# EAGLE schematic controller5 (EAGLE 7.7.0)

## Sheet 1 of 2
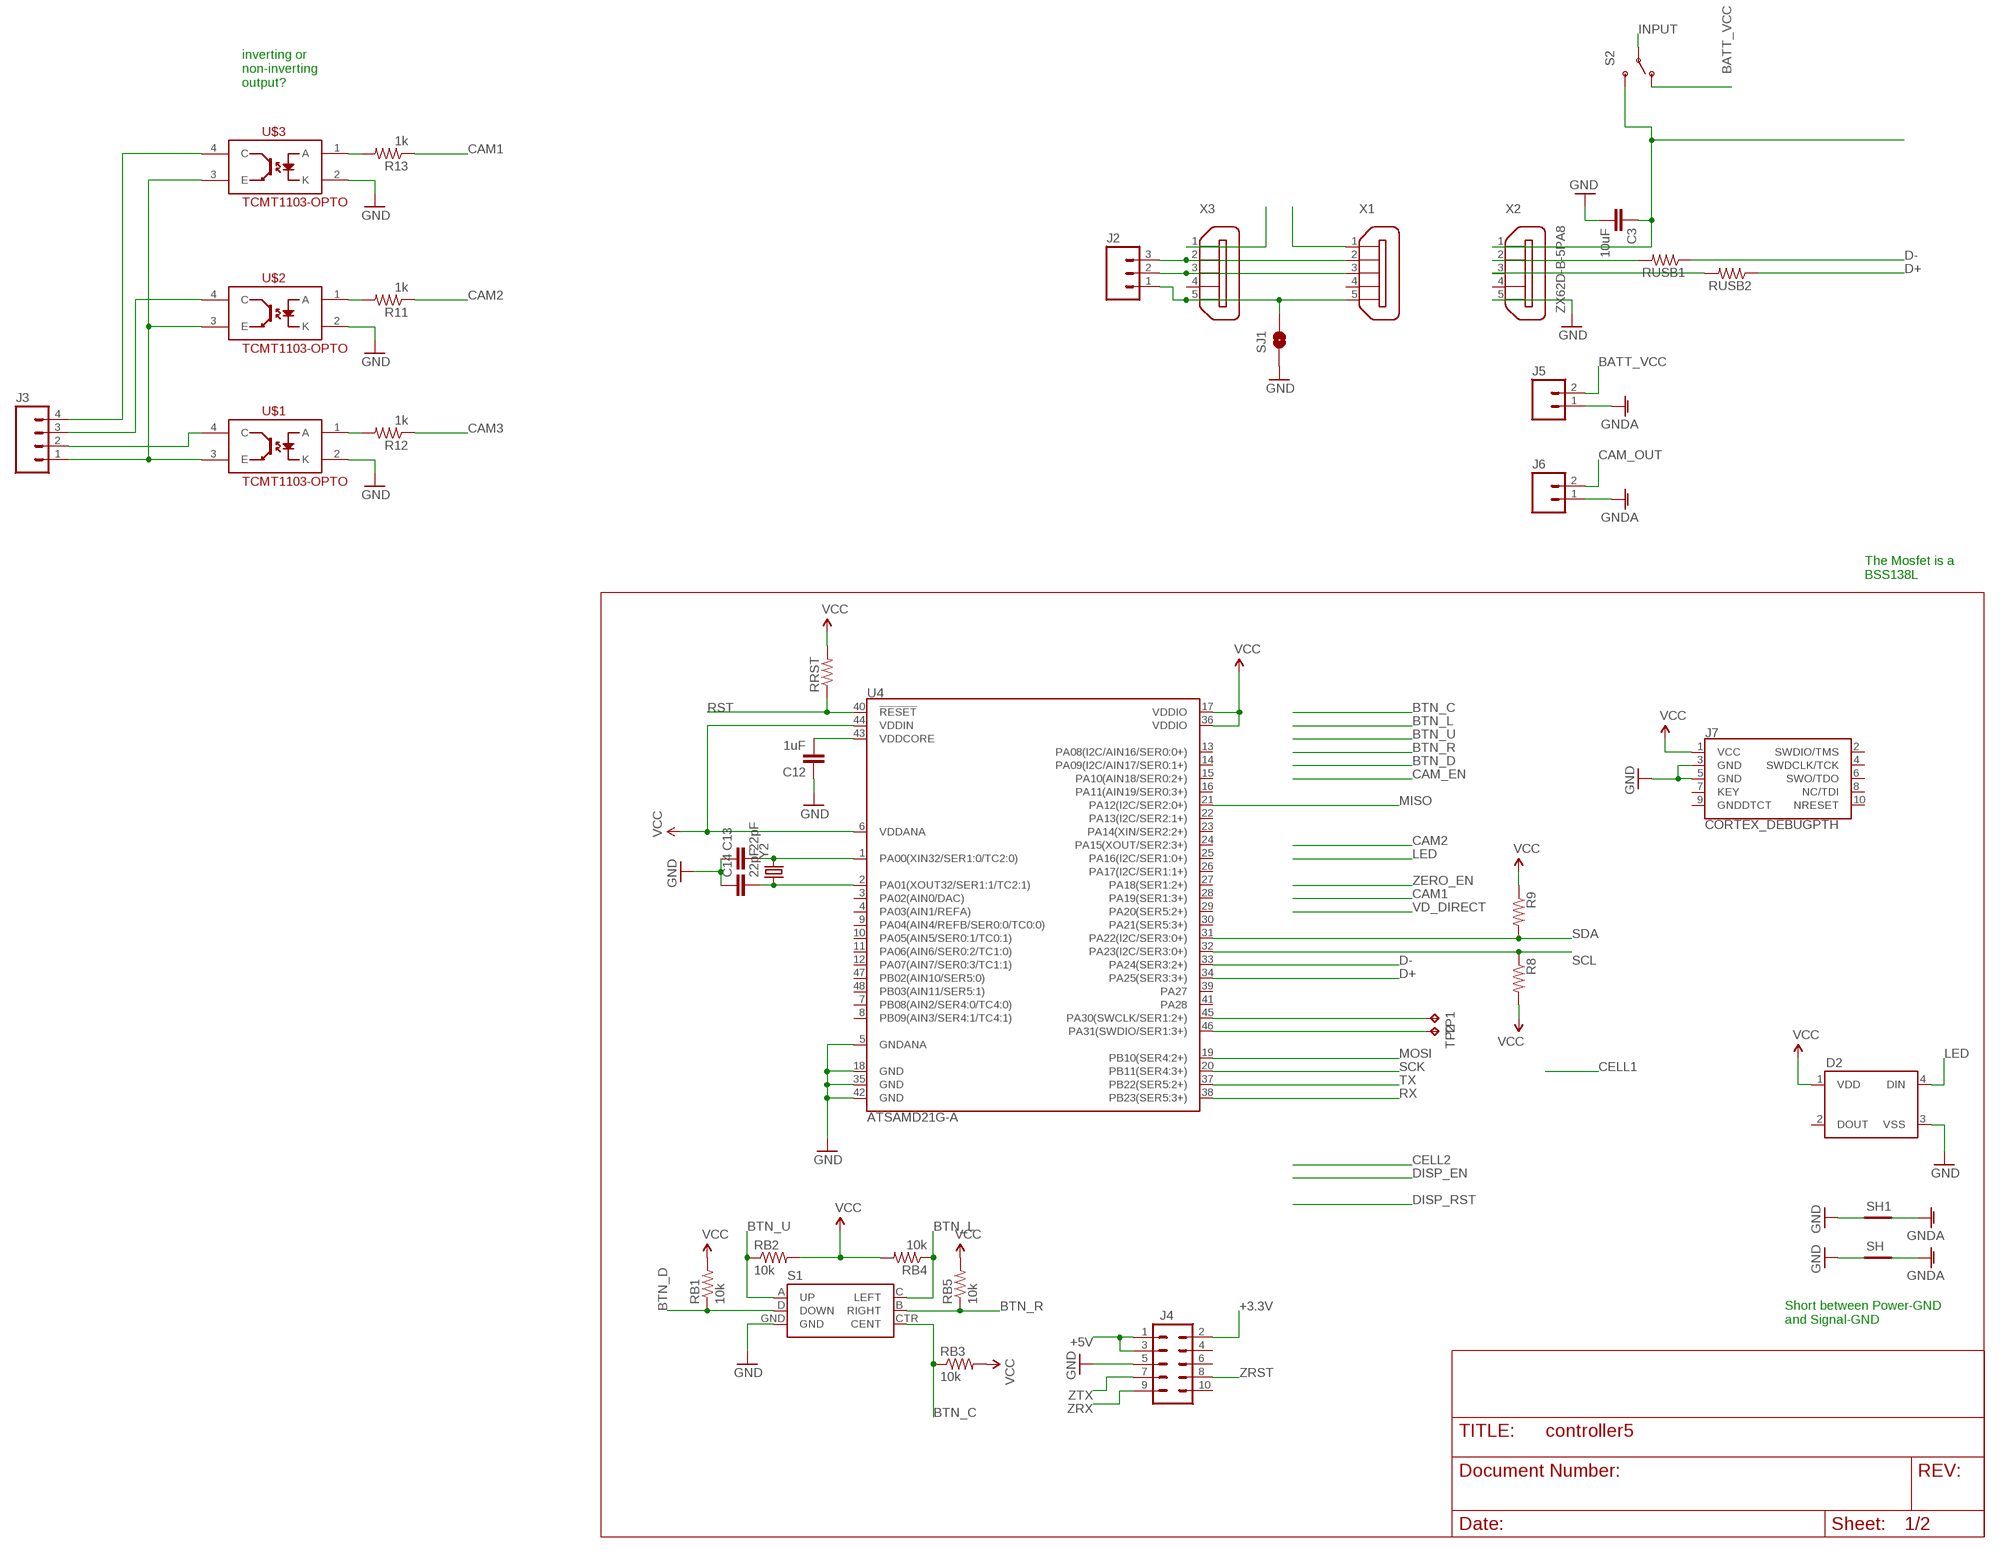
[diagram p0: schematic, sheet 1]

### Parts
C3  10uF  CAP1206  [1206]
C12  1uF  CAP1206  [1206]
C13  22pF  CAP1206  [1206]
C14  22pF  CAP1206  [1206]
D2  WS2812B  [WS2812B]
J2  M03LOCK  [1X03_LOCK]
J3  M04LOCK  [1X04_LOCK]
J4  M05X2NO_SILK  [2X5_NOSILK]
J5  M023.5MM_LOCK  [SCREWTERMINAL-3.5MM-2_LOCK]
J6  M023.5MM_LOCK  [SCREWTERMINAL-3.5MM-2_LOCK]
J7  CORTEX_DEBUGPTH  [2X5-PTH-1.27MM]
R8  RESISTOR1206  [1206]
R9  RESISTOR1206  [1206]
R11  1k  RESISTOR1206  [1206]
R12  1k  RESISTOR1206  [1206]
R13  1k  RESISTOR1206  [1206]
RB1  10k  RESISTOR1206  [1206]
RB2  10k  RESISTOR1206  [1206]
RB3  10k  RESISTOR1206  [1206]
RB4  10k  RESISTOR1206  [1206]
RB5  10k  RESISTOR1206  [1206]
RRST  RESISTOR1206  [1206]
RUSB1  RESISTOR1206  [1206]
RUSB2  RESISTOR1206  [1206]
S1  JOYSTICK_MINI  [JOYSTICK_MINI]
S2  SWITCH-SPDTPTH_LOCK  [SWITCH-SPDT_LOCK.007S]
SH  SHORT-HT5  [SHORT_TOP-50]
SH1  SHORT-HT5  [SHORT_TOP-50]
SJ1  SOLDERJUMPERNO  [SJ_2S-NO]
TP1  TPTP20R  [TP20R]
TP2  TPTP20R  [TP20R]
U4  ATSAMD21G-A  [TQFP-48]
U$1  TCMT1103-OPTO  [SSOP-4]
U$2  TCMT1103-OPTO  [SSOP-4]
U$3  TCMT1103-OPTO  [SSOP-4]
X1  ZX62D-B-5PA8  [ZX62D-B-5PA8]
X2  ZX62D-B-5PA8  [ZX62D-B-5PA8]
X3  ZX62D-B-5PA8  [ZX62D-B-5PA8]
Y2  CRYSTALCRYSTAL-SMD-5X3-16MHZ  [CRYSTAL-SMD-5X3]

### Nets
+3.3V: J4.2
+5V [power]: J4.1 J4.3
BATT_VCC [camera_power]: J5.2 S2.1(O) ; also sheet 2
BTN_C: RB3.1 S1.CTR(CENT)
BTN_D: RB1.1 S1.D(DOWN)
BTN_L: RB4.1 S1.C(LEFT)
BTN_R: RB5.1 S1.B(RIGHT)
BTN_U: RB2.1 S1.A(UP)
CAM1: R13.1
CAM2: R11.1
CAM3: R12.1
CAM_OUT [camera_power]: J6.2 ; also sheet 2
D+: RUSB2.1 U4.34(PA25(SER3:3+))
D-: RUSB1.1 U4.33(PA24(SER3:2+))
GND [power]: C3.2 C12.1 C13.1 C14.1 D2.3(VSS) J4.5 J7.3(GND) J7.5(GND) S1.GND SH1.1 SH.1 SJ1.1 U4.5(GNDANA) U4.18(GND) U4.35(GND) U4.42(GND) U$1.2(K) U$2.2(K) U$3.2(K) X2.5 ; also sheet 2
GNDA [camera_power]: J5.1 J6.1 SH1.2 SH.2
INPUT: S2.2(P) ; also sheet 2
LED: D2.4(DIN)
MISO: U4.21(PA12(I2C/SER2:0+))
MOSI: U4.19(PB10(SER4:2+))
N$2: TP1.TP U4.45(PA30(SWCLK/SER1:2+))
N$3: TP2.TP U4.46(PA31(SWDIO/SER1:3+))
N$4: J2.3 X1.2 X3.2
N$5: J2.2 X1.3 X3.3
N$7: J2.1 SJ1.2 X1.5 X3.5
N$8: R11.2 U$2.1(A)
N$9: R12.2 U$1.1(A)
N$10: RUSB1.2 X2.2
N$11: RUSB2.2 X2.3
N$14: X3.1
N$15: X1.1
N$19: J3.1 U$1.3(E) U$2.3(E) U$3.3(E)
N$22: C3.1 S2.3(S) X2.1
N$25: C12.2 U4.43(VDDCORE)
N$26: R13.2 U$3.1(A)
N$27: C13.2 U4.1(PA00(XIN32/SER1:0/TC2:0)) Y2.3
N$28: C14.2 U4.2(PA01(XOUT32/SER1:1/TC2:1)) Y2.1
N$30: J3.2 U$1.4(C)
N$37: J3.3 U$2.4(C)
N$38: J3.4 U$3.4(C)
RST: RRST.1 U4.40(!RESET!)
RX: U4.38(PB23(SER5:3+))
SCK: U4.20(PB11(SER4:3+))
SCL: R8.1 U4.32(PA23(I2C/SER3:0+)) ; also sheet 2
SDA: R9.2 U4.31(PA22(I2C/SER3:0+)) ; also sheet 2
TX: U4.37(PB22(SER5:2+))
VCC [power]: D2.1(VDD) J7.1(VCC) R8.2 R9.1 RB1.2 RB2.2 RB3.2 RB4.2 RB5.2 RRST.2 U4.6(VDDANA) U4.17(VDDIO) U4.36(VDDIO) U4.44(VDDIN) ; also sheet 2
ZRST: J4.8
ZRX: J4.9
ZTX: J4.7
Unconnected: D2.2(DOUT) J4.4 J4.6 J4.10 J7.2(SWDIO/TMS) J7.4(SWDCLK/TCK) J7.6(SWO/TDO) J7.7(KEY) J7.8(NC/TDI) J7.9(GNDDTCT) J7.10(NRESET) U4.3(PA02(AIN0/DAC)) U4.4(PA03(AIN1/REFA)) U4.7(PB08(AIN2/SER4:0/TC4:0)) U4.8(PB09(AIN3/SER4:1/TC4:1)) U4.9(PA04(AIN4/REFB/SER0:0/TC0:0)) U4.10(PA05(AIN5/SER0:1/TC0:1)) U4.11(PA06(AIN6/SER0:2/TC1:0)) U4.12(PA07(AIN7/SER0:3/TC1:1)) U4.13(PA08(I2C/AIN16/SER0:0+)) U4.14(PA09(I2C/AIN17/SER0:1+)) U4.15(PA10(AIN18/SER0:2+)) U4.16(PA11(AIN19/SER0:3+)) U4.22(PA13(I2C/SER2:1+)) U4.23(PA14(XIN/SER2:2+)) U4.24(PA15(XOUT/SER2:3+)) U4.25(PA16(I2C/SER1:0+)) U4.26(PA17(I2C/SER1:1+)) U4.27(PA18(SER1:2+)) U4.28(PA19(SER1:3+)) U4.29(PA20(SER5:2+)) U4.30(PA21(SER5:3+)) U4.39(PA27) U4.41(PA28) U4.47(PB02(AIN10/SER5:0)) U4.48(PB03(AIN11/SER5:1)) X1.4 X1.S1 X1.S2 X1.S3 X1.S4 X2.4 X2.S1 X2.S2 X2.S3 X2.S4 X3.4 X3.S1 X3.S2 X3.S3 X3.S4

### Notes on the sheet
- inverting or
  non-inverting
  output?
- The Mosfet is a
  BSS138L
- Short between Power-GND
  and Signal-GND

## Sheet 2 of 2
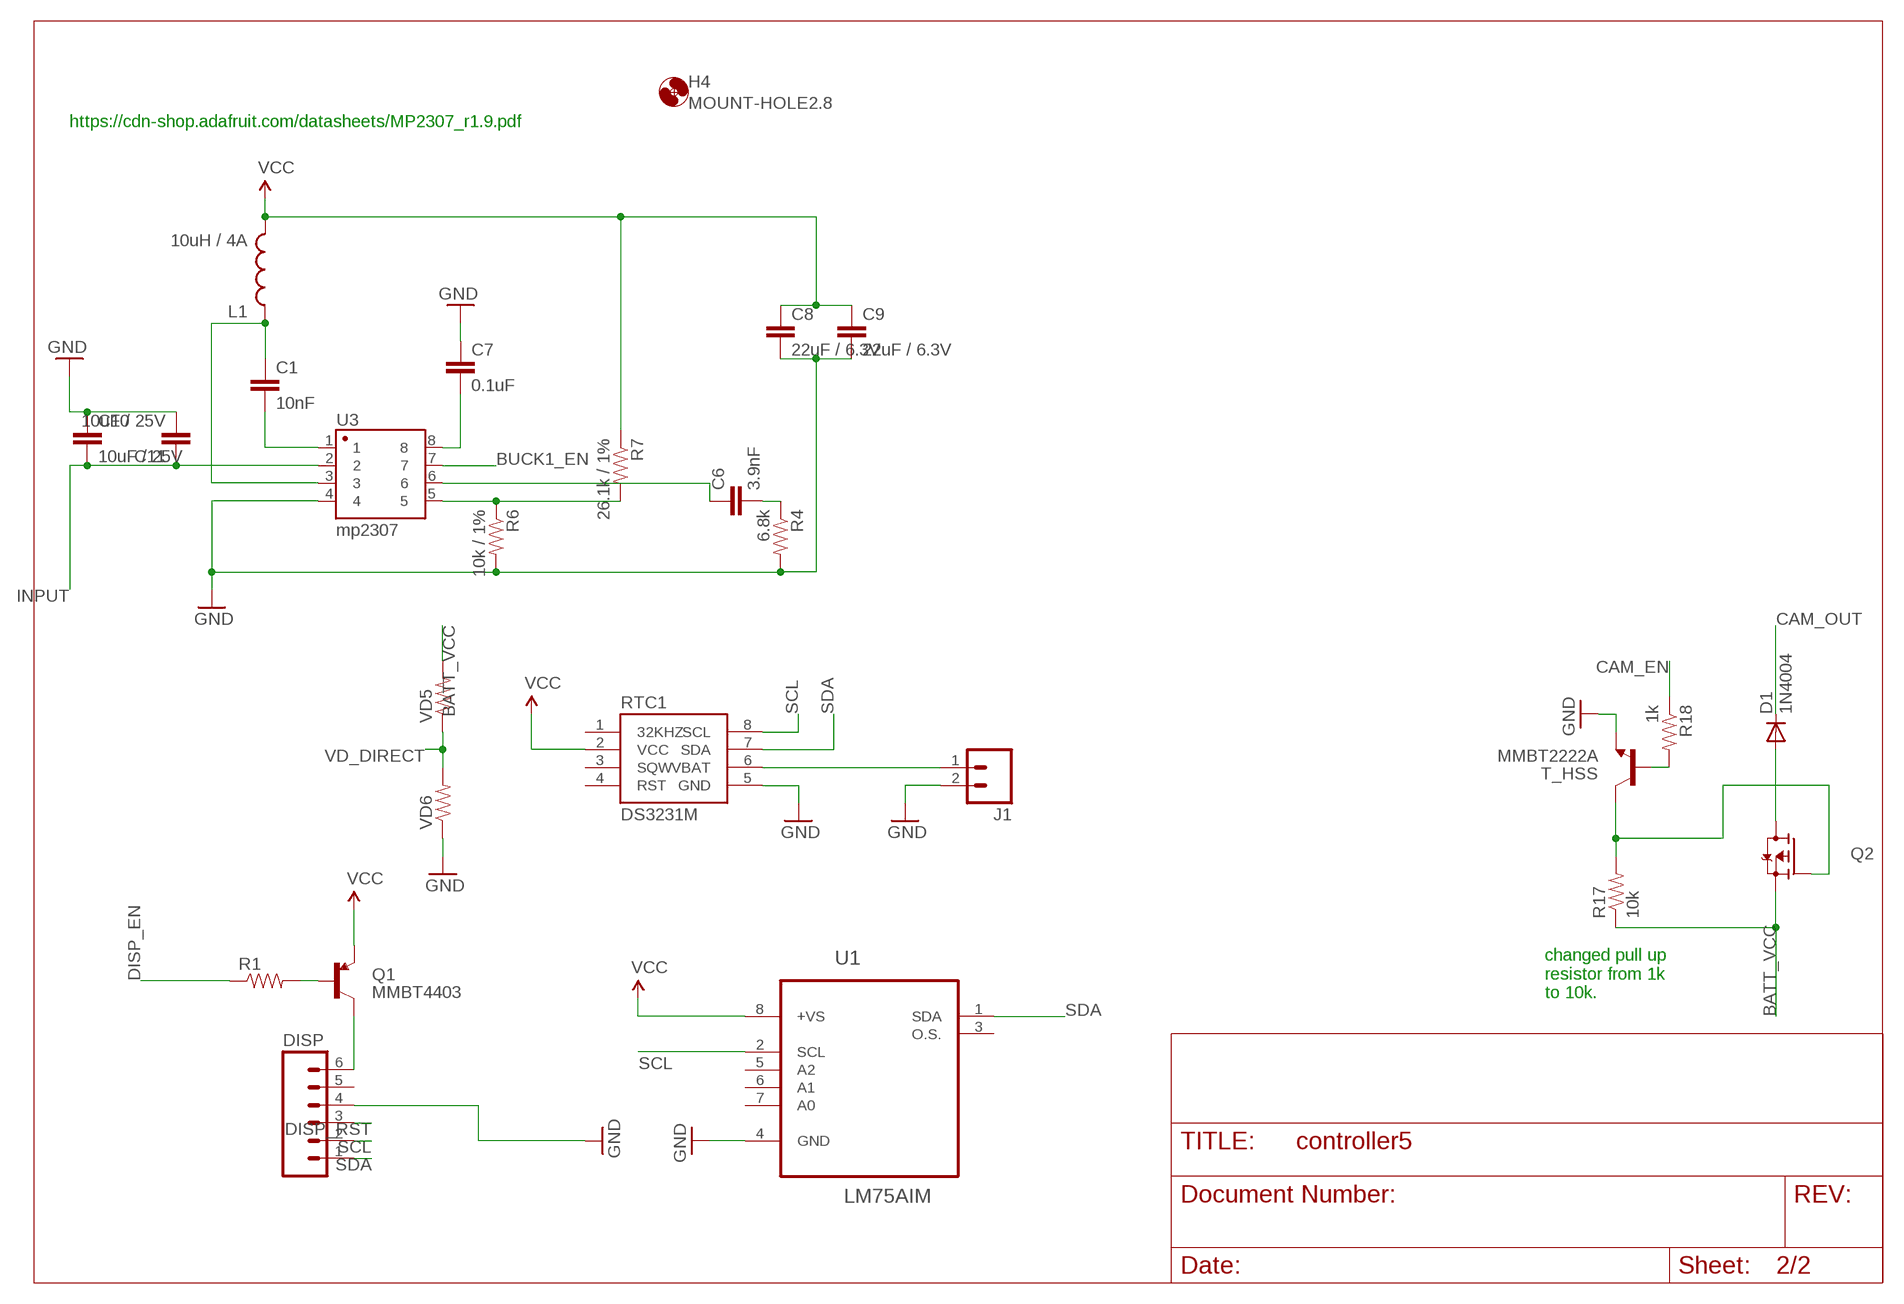
[diagram p1: schematic, sheet 2]

### Parts
C1  10nF  CAP1206  [1206]
C6  3.9nF  CAP1206  [1206]
C7  0.1uF  CAP1206  [1206]
C8  22uF / 6.3V  CAP1206  [1206]
C9  22uF / 6.3V  CAP1206  [1206]
C10  10uF / 25V  CAP1206  [1206]
C11  10uF / 25V  CAP1206  [1206]
D1  1N4004  [DO41-10]
DISP  M06FEMALE_LOCK  [1X06_FEMALE_LOCK.010]
H4  MOUNT-HOLE2.8  [2,8]
J1  M02LOCK_LONGPADS  [1X02_LOCK_LONGPADS]
L1  10uH / 4A  INDUCTORSDR0403-560KL  [SDR0403]
Q1  MMBT4403  TRANSISTOR_PNPMMBT4403  [SOT23-3]
Q2  FDD4141TO252  [TO252]
R1  RESISTOR1206  [1206]
R4  6.8k  RESISTOR1206  [1206]
R6  10k / 1%  RESISTOR1206  [1206]
R7  26.1k / 1%  RESISTOR1206  [1206]
R17  10k  RESISTOR1206  [1206]
R18  1k  RESISTOR1206  [1206]
RTC1  DS3231M  [SOIC8]
T_HSS  MMBT2222A  TRANSISTOR_NPNMMBT2222A  [SOT23-3]
U1  LM75AIM  [SOIC127P620X175-8N]
U3  mp2307  GENERIC-SOIC8  [SO08-UNIVERSAL]
VD5  RESISTOR1206  [1206]
VD6  RESISTOR1206  [1206]

### Nets
BATT_VCC [camera_power]: Q2.2(S) R17.1 VD5.2 ; also sheet 1
BUCK1_EN: U3.7
CAM_EN: R18.1 ; also sheet 1
CAM_OUT [camera_power]: D1.C ; also sheet 1
DISP_EN: R1.1 ; also sheet 1
DISP_RST: DISP.3 ; also sheet 1
GND [power]: C7.1 C8.2 C9.2 C10.1 C11.2 DISP.4 J1.2 R4.2 R6.2 RTC1.5(GND) T_HSS.2(E) U1.4(GND) U3.4 VD6.1 ; also sheet 1
INPUT: C10.2 C11.1 U3.2 ; also sheet 1
N$1: C1.1 L1.P$1 U3.3
N$6: DISP.6 Q1.3(C)
N$12: Q1.1(B) R1.2
N$13: C1.2 U3.1
N$16 [camera_power]: D1.A Q2.3(D)
N$17: C7.2 U3.8
N$21: R6.1 R7.2 U3.5
N$23: C6.1 U3.6
N$24: C6.2 R4.1
N$31: R18.2 T_HSS.1(B)
N$36: Q2.1(G) R17.2 T_HSS.3(C)
SCL: DISP.2 RTC1.8(SCL) U1.2(SCL) ; also sheet 1
SDA: DISP.1 RTC1.7(SDA) U1.1(SDA) ; also sheet 1
VBAT: J1.1 RTC1.6(VBAT)
VCC [power]: C8.1 C9.1 L1.P$2 Q1.2(E) R7.1 RTC1.2(VCC) U1.8(+VS) ; also sheet 1
VD_DIRECT: VD5.1 VD6.2 ; also sheet 1
Unconnected: DISP.5 RTC1.1(32KHZ) RTC1.3(SQW) RTC1.4(RST) U1.3(O.S.) U1.5(A2) U1.6(A1) U1.7(A0)

### Notes on the sheet
- https://cdn-shop.adafruit.com/datasheets/MP2307_r1.9.pdf
- changed pull up
  resistor from 1k
  to 10k.

## Library data of the parts
C1 C6-C12 = SparkFun-Capacitors:CAP: Capacitor Standard 0603 ceramic capacitor, and 0.1" leaded capacitor.
C3 C13 C14 = SparkFun-Passives:CAP: Capacitor Standard 0603 ceramic capacitor, and 0.1" leaded capacitor.
D1 = adafruit:1N4004: DIODE General purpose 1N400x type rectifier (With bigger pads) http://www.ladyada.net/library/pcb/eaglelibrary.html
D2 = SparkFun-LED:WS2812B: WS2812B - Intelligent control LED integrated light source Technical Specifications: Power Supply Voltage (VDD): 3.5 to 5.3 V Input Voltage (VI): -0.5 to VDD+0.5 V Operating Junction Temperature (Topt): -25°C to +80°C Storage Temperature Range (Tstg): -55°C to +150°C; PROD_ID: DIO-12503
DISP = SparkFun-Connectors:M06: Header 6 Standard 6-pin 0.1" header. Use with straight break away headers (SKU : PRT-00116), right angle break away headers (PRT-00553), swiss pins (PRT-00743), machine pins (PRT-00117), and female headers (PRT-00115). Molex polarized connector foot print use with SKU : PRT-08094 with associated crimp pins and housings. NOTES ON THE VARIANTS LOCK and LOCK_LONGPADS... This footprint was designed to help hold the alignment of a through-hole component (i.e. 6-pin header) while soldering it into place. You may notice that each hole has been shifted either up or down by 0.005 of an inch from it's more standard position (which is a perfectly straight line). This slight alteration caused the pins (the squares in the middle) to touch the edges of the holes. Because they are alternating, it causes a "brace" to hold the component in place. 0.005 has proven to be the perfect amount of "off-center" position when using our standard breakaway headers. Although looks a little odd when you look at the bare footprint, once you have a header in there, the alteration is very hard to notice. Also,if you push a header all the way into place, it is covered up entirely on the bottom side. This idea of altering the position of holes to aid alignment will be further integrated into the Sparkfun Library for other footprints. It can help hold any component with 3 or more connection pins.
H4 = holes:MOUNT-HOLE: MOUNTING HOLE with drill center marker
J1 = SparkFun-Connectors:M02: Standard 2-pin 0.1" header. Use with - straight break away headers ( PRT-00116) - right angle break away headers (PRT-00553) - swiss pins (PRT-00743) - machine pins (PRT-00117) - female headers (PRT-00115) Molex polarized connector foot print use with: PRT-08233 with associated crimp pins and housings. 2.54_SCREWTERM for use with PRT-10571. 3.5mm Screw Terminal footprints for PRT-08084 5mm Screw Terminal footprints for use with PRT-08432
J2 = SparkFun-Connectors:M03: Header 3 Standard 3-pin 0.1" header. Use with straight break away headers (SKU : PRT-00116), right angle break away headers (PRT-00553), swiss pins (PRT-00743), machine pins (PRT-00117), and female headers (PRT-00115). Molex polarized connector foot print use with SKU : PRT-08232 with associated crimp pins and housings.
J3 = SparkFun-Connectors:M04: Header 4 Standard 4-pin 0.1" header. Use with straight break away headers (SKU : PRT-00116), right angle break away headers (PRT-00553), swiss pins (PRT-00743), machine pins (PRT-00117), and female headers (PRT-00115). Molex polarized connector foot print use with SKU : PRT-08231 with associated crimp pins and housings. 1MM SMD Version SKU: PRT-10208; PROD_ID: CONN-09696
J4 = SparkFun-Connectors:M05X2: Header 5x2 Standard 10-pin dual row 0.1" header. Commonly used with AVR-ISP. Use with Spark Fun Electronics SKU: PRT-00778
J5 J6 = SparkFun-Connectors:M02: Standard 2-pin 0.1" header. Use with - straight break away headers ( PRT-00116) - right angle break away headers (PRT-00553) - swiss pins (PRT-00743) - machine pins (PRT-00117) - female headers (PRT-00115) Molex polarized connector foot print use with: PRT-08233 with associated crimp pins and housings. 2.54_SCREWTERM for use with PRT-10571. 3.5mm Screw Terminal footprints for PRT-08084 5mm Screw Terminal footprints for use with PRT-08432; PROD_ID: CONN-08399
J7 = SparkFun-Connectors:CORTEX_DEBUG: Cortex Debug Connector Datasheet <http://infocenter.arm.com/help/topic/com.arm.doc.faqs/attached/13634/cortex_debug_connectors.pdf>
L1 = SparkFun-Passives:INDUCTOR: Inductors Basic Inductor/Choke - 0603 and 1206. Footprints are not proven and vary greatly between part numbers. INDUCTOR POWER 3.3UH 4.0A SMD 0.197" L x 0.197" W x 0.177" H (5.00mm x 5.00mm x 4.50mm); DIST: DIGIKEY; DIST_ID: SDR0403-560KLCT-ND; VALUE: 56uH
Q1 = SparkFun-DiscreteSemi:TRANSISTOR_PNP: Generic PNP BJT Double check pinouts against datasheets- not all devices are the same! MMBT3906 - 40V 200mA SOT-23 (TRANS-08052) MMBT4403 - 40V 600mA SOT-23 (TRANS-09245); PROD_ID: TRANS-09245
Q2 = transistor-fet:FDD4141: P-Channel PowerTrench® MOSFET Source: FDD4141.pdf
R1 R4 R6 R7 R11-R13 R17 R18 RB1-RB5 = SparkFun-Resistors:RESISTOR: Resistor Basic schematic elements and footprints for 0603, 1206, and PTH resistors.
R8 R9 RRST RUSB1 RUSB2 VD5 VD6 = SparkFun-Passives:RESISTOR: Resistor Basic schematic elements and footprints for 0603, 1206, and PTH resistors.
RTC1 = SparkFun-DigitalIC:DS3231M: DS3231M Real Time Clock. Accuracy +/-5ppm. Battery Backup. 2.3V to 5.5V.; PROD_ID: IC-11985
S1 = SparkFun-Electromechanical:JOYSTICK_MINI: Small 5-way tactile joystick, COM-10063 4UCON SF303GJ26; PROD_ID: SWCH-09905
S2 = SparkFun-Electromechanical:SWITCH-SPDT: SPDT Switch Simple slide switch, Spark Fun Electronics SKU : COM-00102 DPDT SMT slide switch, AYZ0202, SWCH-08179
SH SH1 = shorts-old:SHORT-H: Short between two nets; BOM: no
SJ1 = SparkFun-Retired:SOLDERJUMPER: Solder Jumper Standard SMD solder jumper. Used to automate production. Two varients : Normally Open and Normally Closed are the same, but have different paste layers. NC will have a large amount of paste and should jumper during reflow.
T_HSS = SparkFun-DiscreteSemi:TRANSISTOR_NPN: Generic NPN BJT MMBT2222A - TRANS-08049 (SOT-23, 1A 40V) MPSA42 - TRANS-09116 (SOT-23, 500mA 300V) MMBT5088LT1G - TRANS-11160 (SOT-23, 50 mA 30V) BC547 - COM-08928 <http://www.sparkfun.com/products/8928> (TO-92 45V 100mA) (1.Collector 2.Base 3.Emitter) 2N3904 - COM-00521 <http://www.sparkfun.com/products/521> (TO-92 40V 200mA) (1.Emitter 2.Base 3.Collector) P2N2222A - COM-12852 <http://www.sparkfun.com/products/12852> (TO-92 40V 600mA) (1.Collector 2.Base 3.Emitter); PROD_ID: TRANS-08049
TP1 TP2 = testpad:TP: Test pad
U1 = NSC_By_element14_Batch_1.1:LM75AIM: Digital Temperature Sensor; MPN: LM75AIM; OC_FARNELL: 1699380; OC_NEWARK: -; PACKAGE: SOIC-8; SUPPLIER: NATIONAL SEMICONDUCTOR
U3 = SparkFun-AnalogIC:GENERIC-SOIC8: A placeholder for generic narrow & wide SOIC8 foorptints - used on the DIP adapter board.
U4 = SparkFun-DigitalIC:ATSAMD21G: Atmel SAMD21G SMART ARM-Based Microcontroller The Atmel ® | SMART ™ SAM D21 is a series of low-power microcontrollers using the 32-bit ARM ® Cortex ® -M0+ processor, and ranging from 32- to 64-pins with up to 256KB Flash and 32KB of SRAM. The SAM D21 devices operate at a maximum frequency of 48MHz and reach 2.46 CoreMark/MHz. They are designed for simple and intuitive migration with identical peripheral modules, hex compatible code, identical linear address map and pin compatible migration paths between all devices in the product series. All devices include intelligent and flexible peripherals, Atmel Event System for inter-peripheral signaling, and support for capacitive touch button, slider and wheel user interfaces.; PROD_ID: IC-13064
U$1-U$3 = SparkFun-DiscreteSemi:TCMT1103-OPTO: Optoisolator- NPN output
X1-X3 = zx62d-b-5pa8-oshpark_10:ZX62D-B-5PA8: Micro USB Type B Connector - Standard, Shell Through Hole Source: http://www.hirose.co.jp/cataloge_hp/ed_ZX_20140804.pdf; MF: Hirose; MPN: ZX62D-B-5PA8; OC_FARNELL: 2300438; OC_NEWARK: 69W0712
Y2 = SparkFun-FreqCtrl:CRYSTAL: Various standard crystals. Proven footprints.; PROD_ID: XTAL-08218

## Net classes
0 default: width 0.305 mm, clearance 0.254 mm
1 power: width 0.356 mm, clearance 0.254 mm
2 camera_power: width 0.914 mm, clearance 0.254 mm
3 usbsignal: width 0.305 mm, clearance 0.254 mm